# EAGLE design Lüftung_230217 (EAGLE 9.6.2)
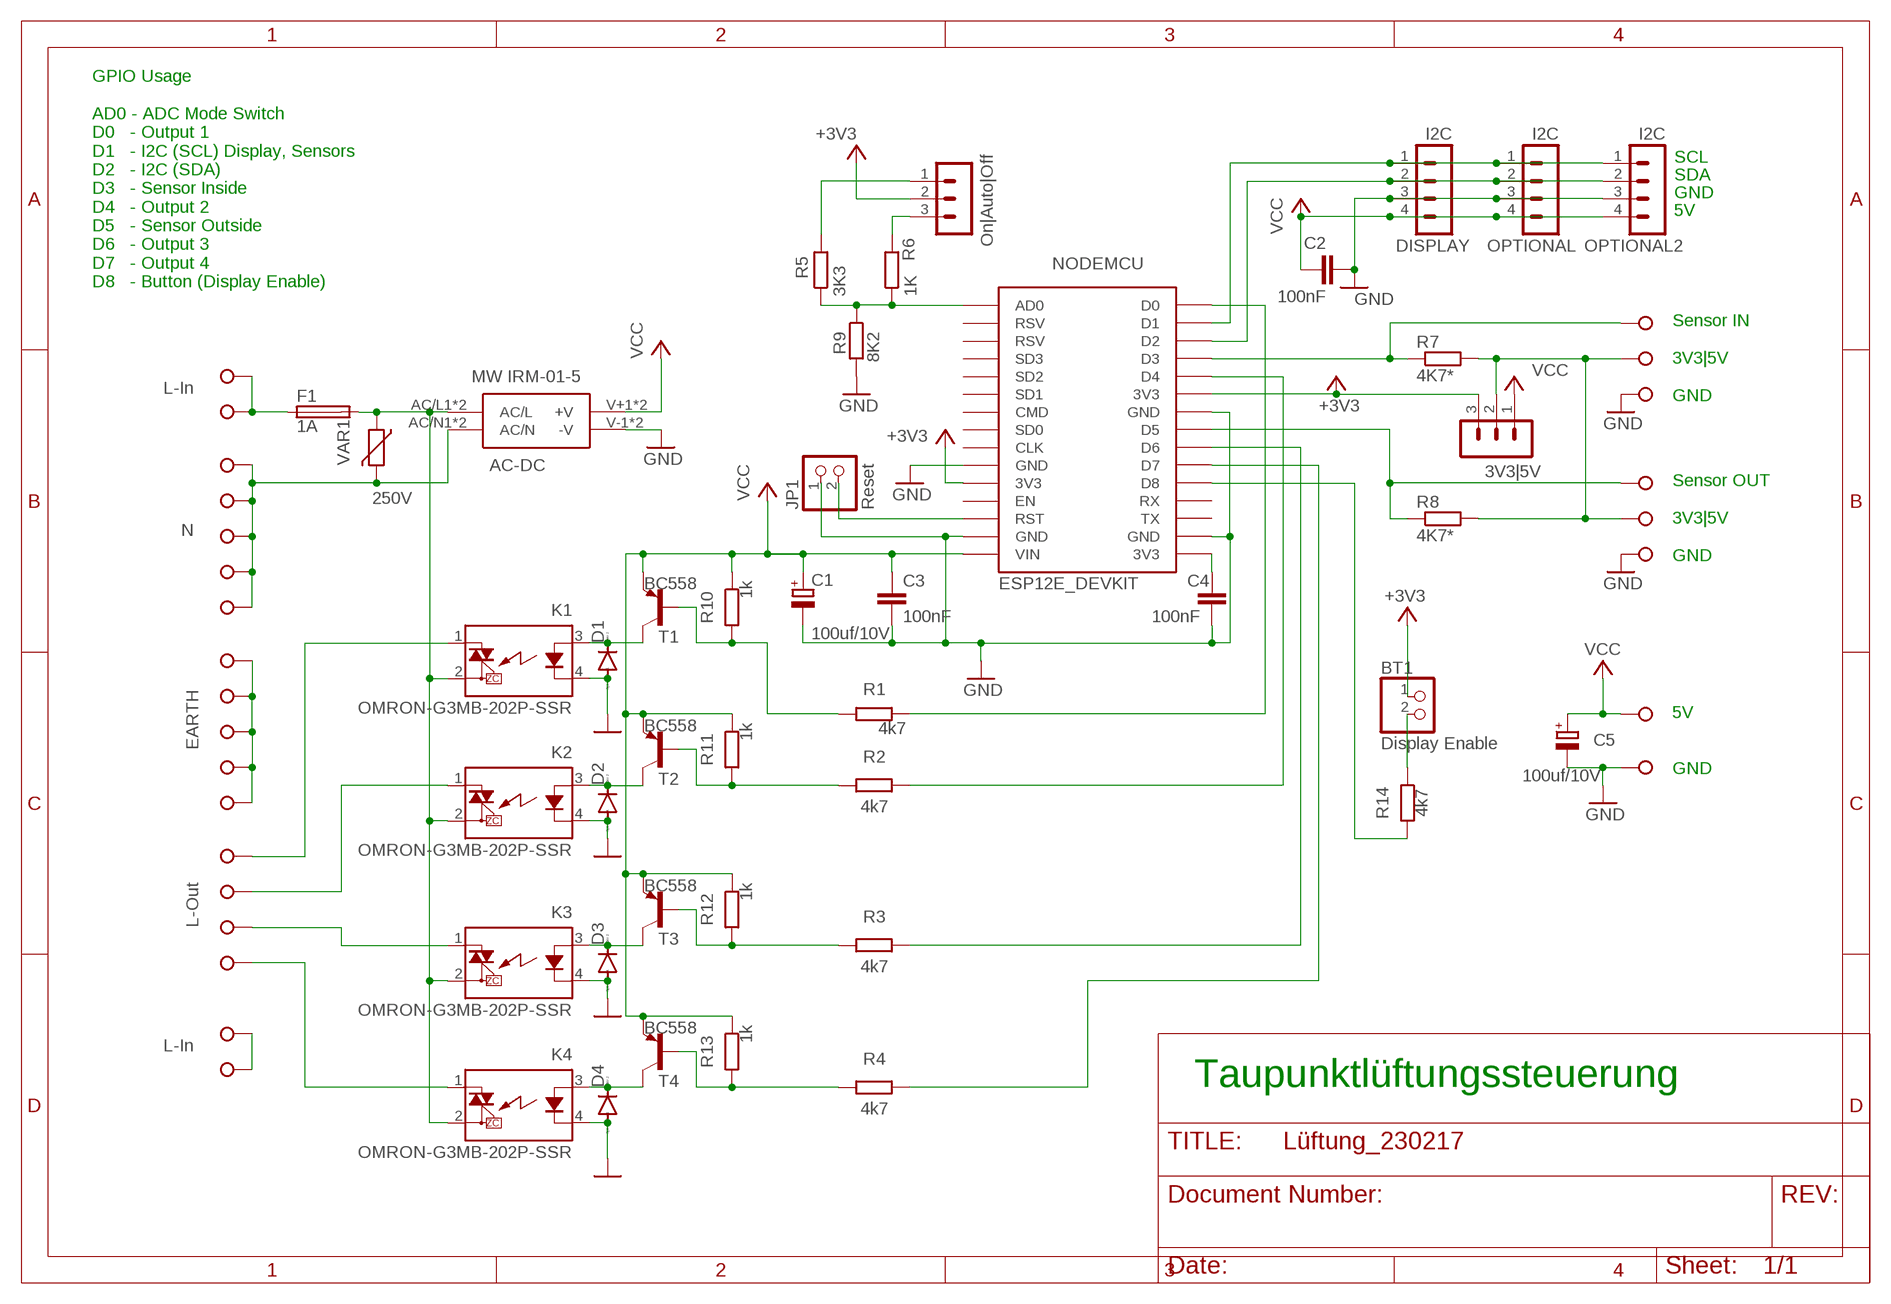
[diagram p0: schematic, sheet 1]

## Parts
5V|3V3  3V3|5V  LüFTUNG_230217_2_CON-LSTB_MA03-1  [LüFTUNG_230217_2_CON-LSTB_MA03-1]
AC-DC  MW IRM-01-5  LüFTUNG_230217_2_SAMACSYS_PARTS_IRM-01-5  [LüFTUNG_230217_2_SAMACSYS_PARTS_IRM015]
BT1  Display Enable  LüFTUNG_230217_2_PINHEAD_PINHD-1X2  [LüFTUNG_230217_2_PINHEAD_1X02]
C1  100uf/10V  LüFTUNG_230217_2_MY_RCL_CPOL-EUE2.5-7  [LüFTUNG_230217_2_MY_RCL_E2,5-7]
C2  100nF  LüFTUNG_230217_2_CAPACITOR-WIMA_C5/3.5  [LüFTUNG_230217_2_CAPACITOR-WIMA_C5B3.5]
C3  100nF  LüFTUNG_230217_2_CAPACITOR-WIMA_C5/3.5  [LüFTUNG_230217_2_CAPACITOR-WIMA_C5B3.5]
C4  100nF  LüFTUNG_230217_2_CAPACITOR-WIMA_C5/3.5  [LüFTUNG_230217_2_CAPACITOR-WIMA_C5B3.5]
C5  100uf/10V  LüFTUNG_230217_2_MY_RCL_CPOL-EUE2.5-7  [LüFTUNG_230217_2_MY_RCL_E2,5-7]
D1  LüFTUNG_230217_2_DIODE_1N4148  [LüFTUNG_230217_2_DIODE_D-5]
D2  LüFTUNG_230217_2_DIODE_1N4148DO35-7  [LüFTUNG_230217_2_DIODE_DO35-7]
D3  LüFTUNG_230217_2_DIODE_1N4148DO35-7  [LüFTUNG_230217_2_DIODE_DO35-7]
D4  LüFTUNG_230217_2_DIODE_1N4148DO35-7  [LüFTUNG_230217_2_DIODE_DO35-7]
DISPLAY  I2C  LüFTUNG_230217_2_CON-LSTB_MA04-1  [LüFTUNG_230217_2_CON-LSTB_MA04-1]
F1  1A  LüFTUNG_230217_2_MY_FUSE_FUSESH22,5  [LüFTUNG_230217_2_MY_FUSE_SH22,5]
JP1  Reset  LüFTUNG_230217_2_PINHEAD_PINHD-1X2  [LüFTUNG_230217_2_PINHEAD_1X02]
K1  OMRON-G3MB-202P-SSR  LüFTUNG_230217_2_OMRON-G3MB-202P-SSR_OMRON-G3MB-202P-SSR  [LüFTUNG_230217_2_OMRON-G3MB-202P-SSR_OMRON-G3MB-202P-SSR]
K2  OMRON-G3MB-202P-SSR  LüFTUNG_230217_2_OMRON-G3MB-202P-SSR_OMRON-G3MB-202P-SSR  [LüFTUNG_230217_2_OMRON-G3MB-202P-SSR_OMRON-G3MB-202P-SSR]
K3  OMRON-G3MB-202P-SSR  LüFTUNG_230217_2_OMRON-G3MB-202P-SSR_OMRON-G3MB-202P-SSR  [LüFTUNG_230217_2_OMRON-G3MB-202P-SSR_OMRON-G3MB-202P-SSR]
K4  OMRON-G3MB-202P-SSR  LüFTUNG_230217_2_OMRON-G3MB-202P-SSR_OMRON-G3MB-202P-SSR  [LüFTUNG_230217_2_OMRON-G3MB-202P-SSR_OMRON-G3MB-202P-SSR]
NODEMCU  ESP12E_DEVKIT  LüFTUNG_230217_2_ESP12E_DEVKIT_ESP12E_DEVKIT  [LüFTUNG_230217_2_ESP12E_DEVKIT_ESP12E_DEVKIT]
OPTIONAL  I2C  LüFTUNG_230217_2_CON-LSTB_MA04-1  [LüFTUNG_230217_2_CON-LSTB_MA04-1]
OPTIONAL2  I2C  LüFTUNG_230217_2_CON-LSTB_MA04-1  [LüFTUNG_230217_2_CON-LSTB_MA04-1]
R1  4k7  LüFTUNG_230217_2_MY_RCL_R-EU_0207/10  [LüFTUNG_230217_2_MY_RCL_0207/10]
R2  4k7  LüFTUNG_230217_2_MY_RCL_R-EU_0207/10  [LüFTUNG_230217_2_MY_RCL_0207/10]
R3  4k7  LüFTUNG_230217_2_MY_RCL_R-EU_0207/10  [LüFTUNG_230217_2_MY_RCL_0207/10]
R4  4k7  LüFTUNG_230217_2_MY_RCL_R-EU_0207/10  [LüFTUNG_230217_2_MY_RCL_0207/10]
R5  3K3  LüFTUNG_230217_2_MY_RCL_R-EU_0204/2V  [LüFTUNG_230217_2_MY_RCL_0204V]
R6  1K  LüFTUNG_230217_2_MY_RCL_R-EU_0204/2V  [LüFTUNG_230217_2_MY_RCL_0204V]
R7  4K7*  LüFTUNG_230217_2_MY_RCL_R-EU_0207/10  [LüFTUNG_230217_2_MY_RCL_0207/10]
R8  4K7*  LüFTUNG_230217_2_MY_RCL_R-EU_0207/10  [LüFTUNG_230217_2_MY_RCL_0207/10]
R9  8K2  LüFTUNG_230217_2_MY_RCL_R-EU_0204/2V  [LüFTUNG_230217_2_MY_RCL_0204V]
R10  1k  LüFTUNG_230217_2_MY_RCL_R-EU_0207/10  [LüFTUNG_230217_2_MY_RCL_0207/10]
R11  1k  LüFTUNG_230217_2_MY_RCL_R-EU_0207/10  [LüFTUNG_230217_2_MY_RCL_0207/10]
R12  1k  LüFTUNG_230217_2_MY_RCL_R-EU_0207/10  [LüFTUNG_230217_2_MY_RCL_0207/10]
R13  1k  LüFTUNG_230217_2_MY_RCL_R-EU_0207/10  [LüFTUNG_230217_2_MY_RCL_0207/10]
R14  4k7  LüFTUNG_230217_2_MY_RCL_R-EU_0207/10  [LüFTUNG_230217_2_MY_RCL_0207/10]
SWITCH  On|Auto|Off  LüFTUNG_230217_2_CON-LSTB_MA03-1  [LüFTUNG_230217_2_CON-LSTB_MA03-1]
T1  BC558  LüFTUNG_230217_2_TRANSISTOR-NEU-TO92_-PNP-TO92  [LüFTUNG_230217_2_TRANSISTOR-NEU-TO92_TO92]
T2  BC558  LüFTUNG_230217_2_TRANSISTOR-NEU-TO92_-PNP-TO92  [LüFTUNG_230217_2_TRANSISTOR-NEU-TO92_TO92]
T3  BC558  LüFTUNG_230217_2_TRANSISTOR-NEU-TO92_-PNP-TO92  [LüFTUNG_230217_2_TRANSISTOR-NEU-TO92_TO92]
T4  BC558  LüFTUNG_230217_2_TRANSISTOR-NEU-TO92_-PNP-TO92  [LüFTUNG_230217_2_TRANSISTOR-NEU-TO92_TO92]
VAR1  250V  LüFTUNG_230217_2_MY_VARISTOR_VARISTOR-5  [LüFTUNG_230217_2_MY_VARISTOR_R-5]
X1  L-In  CON-WAGO-508_W236-1  [CON-WAGO-508_W236-1]
X2  L-In  CON-WAGO-508_W236-1CON-WAGO-508_W236-NOCAP  [CON-WAGO-508_W236-NOCAP]
X3  N  CON-WAGO-508_W236-1  [CON-WAGO-508_W236-1]
X4  N  CON-WAGO-508_W236-1CON-WAGO-508_W236-NOCAP  [CON-WAGO-508_W236-NOCAP]
X5  N  CON-WAGO-508_W236-1CON-WAGO-508_W236-NOCAP  [CON-WAGO-508_W236-NOCAP]
X6  N  CON-WAGO-508_W236-1CON-WAGO-508_W236-NOCAP  [CON-WAGO-508_W236-NOCAP]
X7  N  CON-WAGO-508_W236-1CON-WAGO-508_W236-NOCAP  [CON-WAGO-508_W236-NOCAP]
X8  EARTH  CON-WAGO-508_W236-1  [CON-WAGO-508_W236-1]
X9  EARTH  CON-WAGO-508_W236-1CON-WAGO-508_W236-NOCAP  [CON-WAGO-508_W236-NOCAP]
X10  EARTH  CON-WAGO-508_W236-1CON-WAGO-508_W236-NOCAP  [CON-WAGO-508_W236-NOCAP]
X11  EARTH  CON-WAGO-508_W236-1CON-WAGO-508_W236-NOCAP  [CON-WAGO-508_W236-NOCAP]
X12  EARTH  CON-WAGO-508_W236-1CON-WAGO-508_W236-NOCAP  [CON-WAGO-508_W236-NOCAP]
X13  L-Out  CON-WAGO-508_W236-1  [CON-WAGO-508_W236-1]
X14  L-Out  CON-WAGO-508_W236-1CON-WAGO-508_W236-NOCAP  [CON-WAGO-508_W236-NOCAP]
X15  L-Out  CON-WAGO-508_W236-1CON-WAGO-508_W236-NOCAP  [CON-WAGO-508_W236-NOCAP]
X16  L-Out  CON-WAGO-508_W236-1CON-WAGO-508_W236-NOCAP  [CON-WAGO-508_W236-NOCAP]
X17  L-In  CON-WAGO-508_W236-1CON-WAGO-508_W236-NOCAP  [CON-WAGO-508_W236-NOCAP]
X18  L-In  CON-WAGO-508_W236-1  [CON-WAGO-508_W236-1]
X19  Sensor-In  CON-WAGO-508_W236-1CON-WAGO-508_W236-NOCAP  [CON-WAGO-508_W236-NOCAP]
X20  3V3  CON-WAGO-508_W236-1CON-WAGO-508_W236-NOCAP  [CON-WAGO-508_W236-NOCAP]
X21  GND  CON-WAGO-508_W236-1  [CON-WAGO-508_W236-1]
X22  Sensor-Out  CON-WAGO-508_W236-1CON-WAGO-508_W236-NOCAP  [CON-WAGO-508_W236-NOCAP]
X23  3V3  CON-WAGO-508_W236-1CON-WAGO-508_W236-NOCAP  [CON-WAGO-508_W236-NOCAP]
X24  GND  CON-WAGO-508_W236-1  [CON-WAGO-508_W236-1]
X25  GND  CON-WAGO-508_W236-1CON-WAGO-508_W236-NOCAP  [CON-WAGO-508_W236-NOCAP]
X26  VCC  CON-WAGO-508_W236-1  [CON-WAGO-508_W236-1]

## Nets
230V-SWITCH [230V]: X17.1(KL1) X17.2(KL1) X18.1(KL1) X18.2(KL1)
+3V3: 5V|3V3.3 BT1.1 NODEMCU.3V3@0(3V3) NODEMCU.3V3@1(3V3) SWITCH.2
EARTH: X8.1(KL1) X8.2(KL1) X9.1(KL1) X9.2(KL1) X10.1(KL1) X10.2(KL1) X11.1(KL1) X11.2(KL1) X12.1(KL1) X12.2(KL1)
GND: AC-DC.V-1(-V) AC-DC.V-2(-V) C1.- C2.2 C3.2 C4.2 C5.- D1.A D2.A D3.A D4.A DISPLAY.3 JP1.1 K1.4(K) K2.4(K) K3.4(K) K4.4(K) NODEMCU.GND@0(GND) NODEMCU.GND@1(GND) NODEMCU.GND@2(GND) NODEMCU.GND@3(GND) OPTIONAL2.3 OPTIONAL.3 R9.2 X21.1(KL1) X21.2(KL1) X24.1(KL1) X24.2(KL1) X25.1(KL1) X25.2(KL1) ; supply symbol labelled SUPPLY1_GND
L [230V]: F1.1 X1.1(KL1) X1.2(KL1) X2.1(KL1) X2.2(KL1)
L2 [230V]: K2.1(DS1) X14.1(KL1) X14.2(KL1)
L3 [230V]: K3.1(DS1) X15.1(KL1) X15.2(KL1)
L4 [230V]: K4.1(DS1) X16.1(KL1) X16.2(KL1)
L-OUT [230V]: K1.1(DS1) X13.1(KL1) X13.2(KL1)
LF [230V]: AC-DC.AC/L1(AC/L) AC-DC.AC/L2(AC/L) F1.2 K1.2(DS2) K2.2(DS2) K3.2(DS2) K4.2(DS2) VAR1.1
N [230V]: AC-DC.AC/N1(AC/N) AC-DC.AC/N2(AC/N) VAR1.2 X3.1(KL1) X3.2(KL1) X4.1(KL1) X4.2(KL1) X5.1(KL1) X5.2(KL1) X6.1(KL1) X6.2(KL1) X7.1(KL1) X7.2(KL1)
N$1: DISPLAY.1 NODEMCU.D1 OPTIONAL2.1 OPTIONAL.1
N$2: R1.2 R10.2 T1.2(B)
N$3: NODEMCU.D5 R8.1 X22.1(KL1) X22.2(KL1)
N$4: D1.C K1.3(A) T1.3(C)
N$5: NODEMCU.D0 R1.1
N$6: 5V|3V3.2 R7.2 R8.2 X20.1(KL1) X20.2(KL1) X23.1(KL1) X23.2(KL1)
N$7: D4.C K4.3(A) T4.3(C)
N$8: D3.C K3.3(A) T3.3(C)
N$9: R6.2 SWITCH.3
N$10: D2.C K2.3(A) T2.3(C)
N$11: NODEMCU.D4 R2.1
N$12: NODEMCU.D6 R3.1
N$13: NODEMCU.D7 R4.1
N$14: DISPLAY.2 NODEMCU.D2 OPTIONAL2.2 OPTIONAL.2
N$15: NODEMCU.AD0 R5.1 R6.1 R9.1
N$16: R5.2 SWITCH.1
N$17: C4.1 NODEMCU.3V3@2(3V3)
N$18: R2.2 R11.2 T2.2(B)
N$19: R3.2 R12.2 T3.2(B)
N$20: R4.2 R13.2 T4.2(B)
N$21: BT1.2 R14.1
N$22: NODEMCU.D8 R14.2
RST: JP1.2 NODEMCU.RST
SENS_IN: NODEMCU.D3 R7.1 X19.1(KL1) X19.2(KL1)
VCC: 5V|3V3.1 AC-DC.V+1(+V) AC-DC.V+2(+V) C1.+ C2.1 C3.1 C5.+ DISPLAY.4 NODEMCU.VIN OPTIONAL2.4 OPTIONAL.4 R10.1 R11.1 R12.1 R13.1 T1.1(E) T2.1(E) T3.1(E) T4.1(E) X26.1(KL1) X26.2(KL1)
Unconnected: NODEMCU.CLK NODEMCU.CMD NODEMCU.EN NODEMCU.RSV@0(RSV) NODEMCU.RSV@1(RSV) NODEMCU.RX NODEMCU.SD0 NODEMCU.SD1 NODEMCU.SD2 NODEMCU.SD3 NODEMCU.TX

## Notes on the sheet
- SCL
- SDA
- GND
- 5V
- GPIO Usage
  
  AD0 - ADC Mode Switch
  D0   - Output 1
  D1   - I2C (SCL) Display, Sensors
  D2   - I2C (SDA)
  D3   - Sensor Inside
  D4   - Output 2
  D5   - Sensor Outside
  D6   - Output 3
  D7   - Output 4
  D8   - Button (Display Enable)
- Sensor IN
  
  3V3|5V
  
  GND
- Sensor OUT
  
  3V3|5V
  
  GND
- 5V
  
  
  GND
- Taupunktlüftungssteuerung

## Library data of the parts
5V|3V3 SWITCH = Lüftung_230217_2:LüFTUNG_230217_2_CON-LSTB_MA03-1: PIN HEADER; OC_FARNELL: unknown; OC_NEWARK: unknown
AC-DC = Lüftung_230217_2:LüFTUNG_230217_2_SAMACSYS_PARTS_IRM-01-5: Power Supply Encapsulated PCB 5V 1W Source: Datasheet <https://www.meanwell.com/Upload/PDF/IRM-01/IRM-01-SPEC.PDF>; DESCRIPTION: Power Supply Encapsulated PCB 5V 1W; HEIGHT: 15mm; MANUFACTURER_NAME: Mean Well; MANUFACTURER_PART_NUMBER: IRM-01-5; MOUSER_PART_NUMBER: 709-IRM01-5; MOUSER_PRICE-STOCK: https://www.mouser.co.uk/ProductDetail/MEAN-WELL/IRM-01-5?qs=C9r8PV%2F%252BoWMaYlcx2eavRQ%3D%3D
BT1 JP1 = Lüftung_230217_2:LüFTUNG_230217_2_PINHEAD_PINHD-1X2: PIN HEADER
C1 C5 = Lüftung_230217_2:LüFTUNG_230217_2_MY_RCL_CPOL-EU: POLARIZED CAPACITOR, European symbol; SPICEPREFIX: C
C2-C4 = Lüftung_230217_2:LüFTUNG_230217_2_CAPACITOR-WIMA_C: CAPACITOR naming: grid - package width
D1-D4 = Lüftung_230217_2:LüFTUNG_230217_2_DIODE_1N4148: DIODE high speed (Philips)
DISPLAY OPTIONAL OPTIONAL2 = Lüftung_230217_2:LüFTUNG_230217_2_CON-LSTB_MA04-1: PIN HEADER; OC_FARNELL: unknown; OC_NEWARK: unknown
F1 = Lüftung_230217_2:LüFTUNG_230217_2_MY_FUSE_FUSE: Fuse; OC_FARNELL: unknown; OC_NEWARK: unknown
K1-K4 = Lüftung_230217_2:LüFTUNG_230217_2_OMRON-G3MB-202P-SSR_OMRON-G3MB-202P-SSR: IT(rms) 8A, Zero Cross type SIP 4pin Triac output SSR Source: http://sharp-world.com/products/device/lineup/data/pdf/datasheet/s102s02_e.pdf
NODEMCU = Lüftung_230217_2:LüFTUNG_230217_2_ESP12E_DEVKIT_ESP12E_DEVKIT: ESP12E DEVKIT BOARD
R1-R14 = Lüftung_230217_2:LüFTUNG_230217_2_MY_RCL_R-EU_: RESISTOR, European symbol; SPICEPREFIX: R
T1-T4 = Lüftung_230217_2:LüFTUNG_230217_2_TRANSISTOR-NEU-TO92_*-PNP-: PNP Transistror
VAR1 = Lüftung_230217_2:LüFTUNG_230217_2_MY_VARISTOR_VARISTOR: VARISTOR
X1 X3 X8 X13 X18 X21 X24 X26 = Lüftung_230217_2:CON-WAGO-508_W236-1: WAGO SREW CLAMP; OC_FARNELL: unknown; OC_NEWARK: unknown
X2 X4-X7 X9-X12 X14-X17 X19 X20 X22 X23 X25 = Lüftung_230217_2:CON-WAGO-508_W236-1: WAGO SREW CLAMP

## Net classes
0 default: width 0.305 mm
1 230V: width 1.016 mm, clearance 1.5 mm

## Board
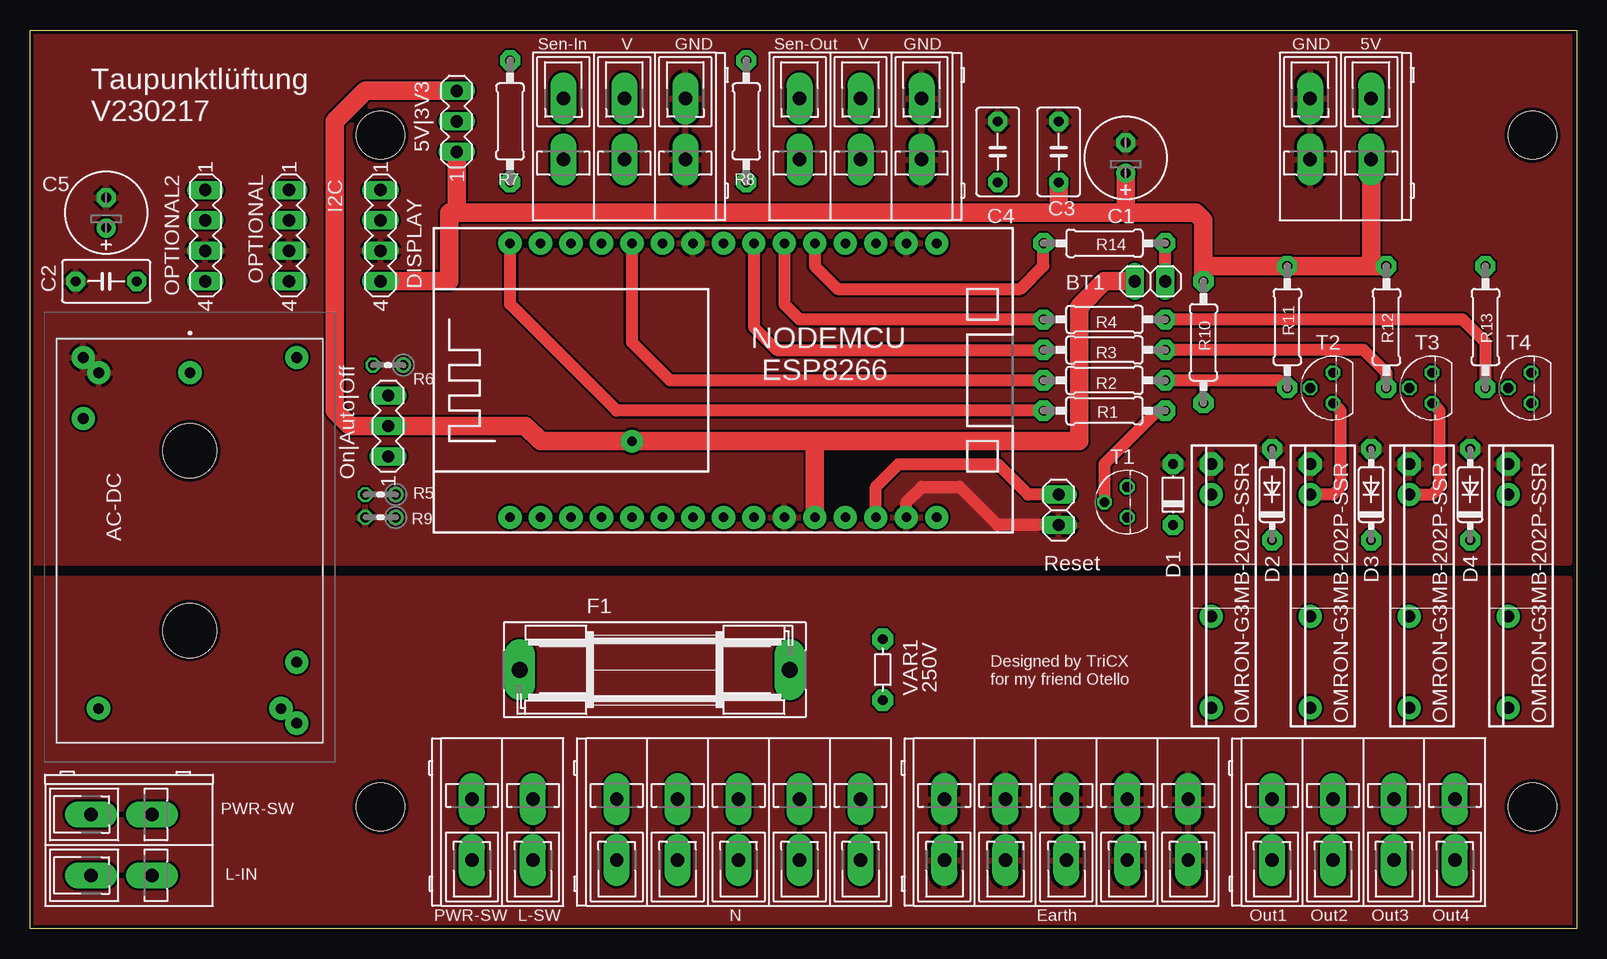
[diagram p1: board, top side]
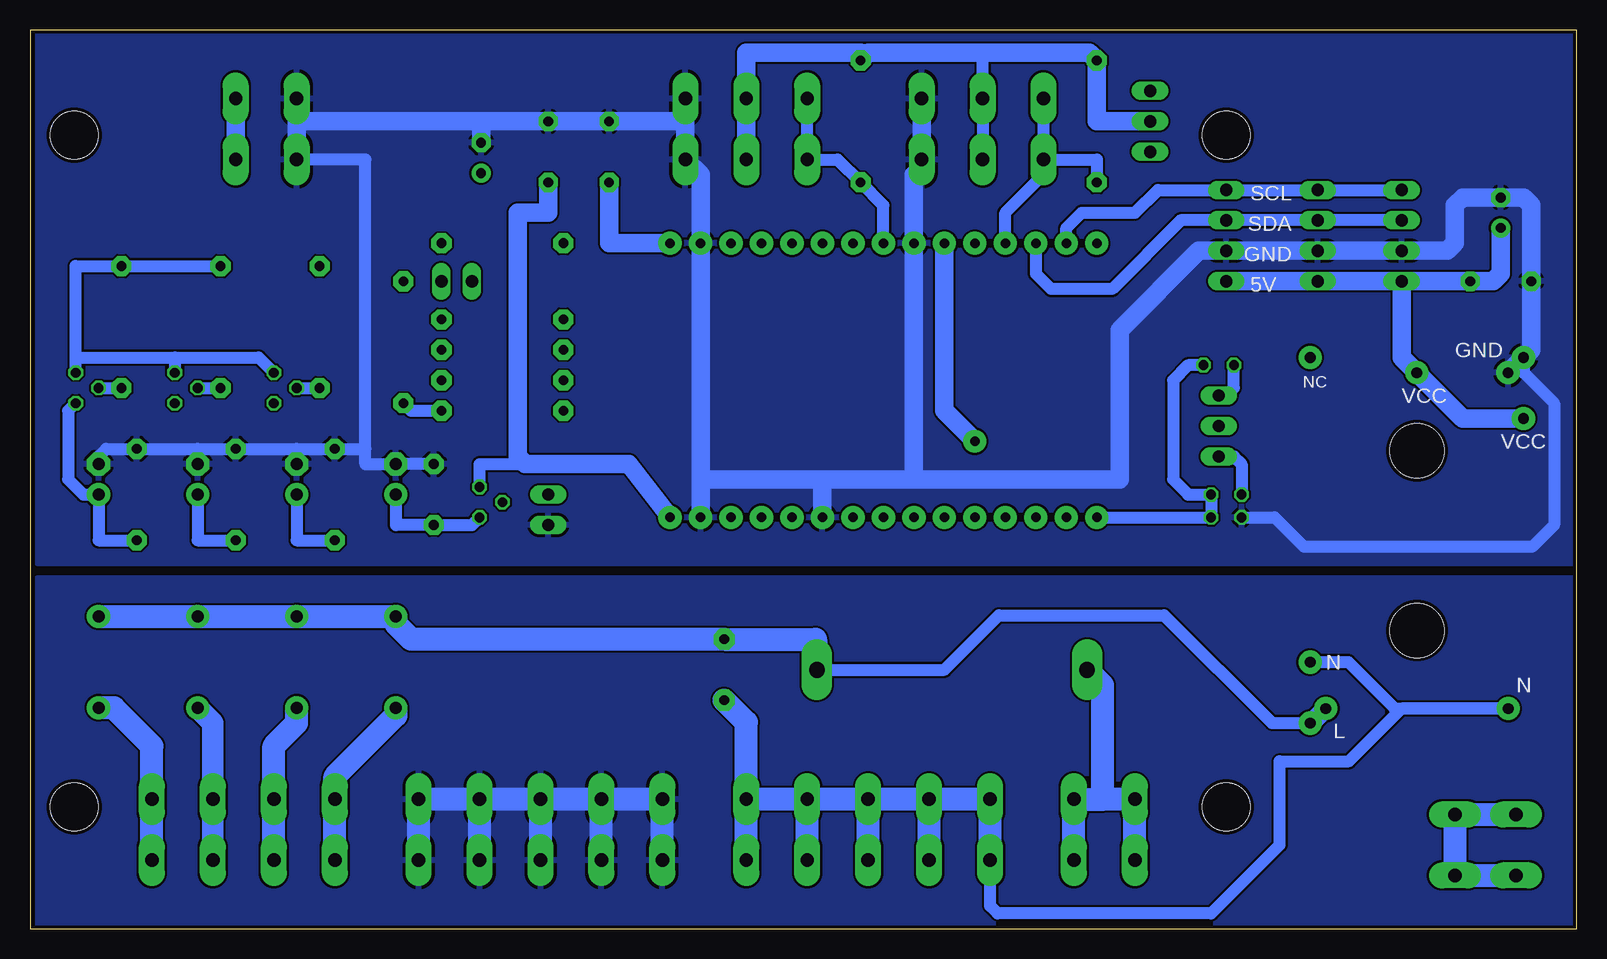
[diagram p2: board, bottom side, seen from below]

Size 128.91 x 74.93 mm. Coordinates in mm from the lower left corner, seen from the top.
Outline: 0,0 0,74.93 128.91,74.93 128.91,0 0,0
Copper layers (1*16): Top 0.035mm / dielectric 1.5mm / Bottom 0.035mm
Design rules "aisler_2_layer_simple": minimum track width 0.2mm, minimum drill 0.45mm, track to track 0.175mm, track to pad 0.175mm, pad to pad 0.175mm, via to via 0.175mm, smd to smd 0.175mm, copper to edge 0.3mm, drill to drill 0.25mm, minimum pad ring 0.2mm, minimum via ring 0.2mm, stop-mask expansion 0mil, vias tented up to drill 0mil, thermal gap 10mil
Holes 4 mm at 29.21,66.16 29.21,10.16 125.21,10.16 125.21,66.16

### Footprints (pad centres in the part's own frame; a part is rotated, then mirrored left to right if it is on the bottom)
LüFTUNG_230217_2_CON-LSTB_MA03-1 = drill 1.016 long: 1 -2.54,0; 2 0,0; 3 2.54,0
LüFTUNG_230217_2_SAMACSYS_PARTS_IRM015 = drill 0.9 pad 1.93: AC/L1 28,7.58; AC/L2 29.21,8.89; AC/N1 28,-7.62; AC/N2 24.13,8.89; NC -1.27,8.89; V+1 0,0; V+2 3.81,-8.89; V-1 0,-7.6; V-2 -1.27,-8.89 | hole 4.5: 6.5,-0.02; 21.5,-0.02
LüFTUNG_230217_2_PINHEAD_1X02 = drill 1.016 long: 1 -1.27,0; 2 1.27,0
LüFTUNG_230217_2_MY_RCL_E2,5-7 = drill 0.813 pad 1.6: + -1.27,0 | drill 0.813 pad 1.6 octagon: - 1.27,0
LüFTUNG_230217_2_CAPACITOR-WIMA_C5B3.5 = drill 0.813 pad 1.6 octagon: 1 -2.54,0; 2 2.54,0
LüFTUNG_230217_2_DIODE_D-5 = drill 0.813 pad 1.676 octagon: A 2.54,0; C -2.54,0
LüFTUNG_230217_2_DIODE_DO35-7 = drill 0.813 pad 1.676 octagon: A 3.81,0; C -3.81,0
LüFTUNG_230217_2_CON-LSTB_MA04-1 = drill 1.016 long: 1 -3.81,0; 2 -1.27,0; 3 1.27,0; 4 3.81,0
LüFTUNG_230217_2_MY_FUSE_SH22,5 = drill 1.321 pad 2.54 long: 1 -11.252,0; 2 11.252,0
LüFTUNG_230217_2_OMRON-G3MB-202P-SSR_OMRON-G3MB-202P-SSR = drill 1 pad 1.93: 1 -10.16,0; 2 -2.54,0; 3 7.62,0 | drill 1 pad 1.93 octagon: 4 10.16,0
LüFTUNG_230217_2_ESP12E_DEVKIT_ESP12E_DEVKIT = drill 0.8 pad 1.93: 3V3@0 -11.43,-7.62; 3V3@1 11.43,5.08; 3V3@2 11.43,-17.78; AD0 -11.43,17.78; CLK -11.43,-2.54; CMD -11.43,2.54; D0 11.43,17.78; D1 11.43,15.24; D2 11.43,12.7; D3 11.43,10.16; D4 11.43,7.62; D5 11.43,0; D6 11.43,-2.54; D7 11.43,-5.08; D8 11.43,-7.62; EN -11.43,-10.16; GND@0 -11.43,-5.08; GND@1 -11.43,-15.24; GND@2 11.43,2.54; GND@3 11.43,-15.24; RST -11.43,-12.7; RSV@0 -11.43,15.24; RSV@1 -11.43,12.7; RX 11.43,-10.16; SD0 -11.43,0; SD1 -11.43,5.08; SD2 -11.43,7.62; SD3 -11.43,10.16; TX 11.43,-12.7; VIN -11.43,-17.78
LüFTUNG_230217_2_MY_RCL_0207/10 = drill 0.813 pad 1.676 octagon: 1 -5.08,0; 2 5.08,0
LüFTUNG_230217_2_MY_RCL_0204V = drill 0.813 octagon: 1 -1.27,0; 2 1.27,0
LüFTUNG_230217_2_TRANSISTOR-NEU-TO92_TO92 = drill 0.813 octagon: 1 1.27,0; 2 0,1.905; 3 -1.27,0
LüFTUNG_230217_2_MY_VARISTOR_R-5 = drill 0.813 pad 1.778 octagon: 1 -2.54,0; 2 2.54,0
CON-WAGO-508_W236-1 = drill 1.118 pad 2.184 long: 1 0,-2.54; 2 0,2.54
CON-WAGO-508_W236-NOCAP = drill 1.118 pad 2.184 long: 1 0,-2.54; 2 0,2.54

### Placement (x,y rotation side)
5V|3V3  35.56,67.31 90 top
AC-DC  13.34,46.36 270 top
BT1  93.34,53.97 0 top
C1  91.31,64.26 90 top
C2  6.35,53.97 180 top
C3  85.72,64.77 90 top
C4  80.65,64.77 90 top
C5  6.35,59.69 90 top
D1  95.25,36.2 90 top
D2  103.5,36.2 90 top
D3  111.76,36.2 90 top
D4  120.02,36.2 90 top
DISPLAY  29.21,57.78 270 top
F1  52.07,21.59 0 top
JP1  85.72,34.92 90 top
K1  98.43,28.57 90 top
K2  106.68,28.57 90 top
K3  114.94,28.57 90 top
K4  123.19,28.57 90 top
NODEMCU  57.78,45.72 90 top
OPTIONAL  21.59,57.78 270 top
OPTIONAL2  14.61,57.78 270 top
R1  89.53,43.18 0 top
R2  89.53,45.72 0 top
R3  89.53,48.26 0 top
R4  89.53,50.8 0 top
R5  29.21,36.2 180 top
R6  29.85,46.99 180 top
R7  40.01,67.31 90 top
R8  59.69,67.31 90 top
R9  29.21,34.29 180 top
R10  97.79,48.89 270 top
R11  104.78,50.17 270 top
R12  113.03,50.17 270 top
R13  121.28,50.17 270 top
R14  89.53,57.15 180 top
SWITCH  29.85,41.91 90 top
T1  91.44,35.56 90 top
T2  108.59,45.08 90 top
T3  116.84,45.08 90 top
T4  125.09,45.08 90 top
VAR1  71.06,21.59 270 top
X1  36.83,8.26 0 top
X2  41.91,8.26 0 top
X3  48.89,8.26 0 top
X4  53.98,8.26 0 top
X5  59.05,8.26 0 top
X6  64.13,8.26 0 top
X7  69.22,8.26 0 top
X8  76.2,8.26 0 top
X9  81.28,8.26 0 top
X10  86.36,8.26 0 top
X11  91.44,8.26 0 top
X12  96.52,8.26 0 top
X13  103.5,8.26 0 top
X14  108.59,8.26 0 top
X15  113.66,8.26 0 top
X16  118.75,8.26 0 top
X17  7.62,4.45 270 top
X18  7.62,9.53 270 top
X19  44.45,66.67 180 top
X20  49.53,66.67 180 top
X21  54.61,66.67 180 top
X22  64.13,66.67 180 top
X23  69.22,66.67 180 top
X24  74.3,66.67 180 top
X25  106.68,66.67 180 top
X26  111.76,66.67 180 top

### Tracks (layer width: path | path; a pad name or v marks a point on that pad's centre or on a via)
230V-SWITCH
  Bottom 1.905: X17.1 X17.2 X18.2 X18.1
+3V3  (via drill 0.8 pad 1.91)
  Top 1.524: 65.41,40.64 v50.16,40.64 42.55,40.64 41.27,41.91 SWITCH.2 26.67,41.91 25.4,43.18 25.4,67.31 27.94,69.85 5V|3V3.3 | NODEMCU.3V3@0 65.41,40.64 | 65.41,40.64 87.43,40.64 87.43,51.87 89.53,53.97 BT1.1
  Bottom 1.524: NODEMCU.3V3@1 52.7,43.18 v50.16,40.64
EARTH
  Bottom 1.905: X12.1 X12.2 X11.2 | X11.1 X11.2 | X10.1 X10.2 | X9.1 X9.2 | X8.1 X8.2 X9.2 | X9.2 X10.2 | X10.2 X11.2
  pour Top: -0.63,29.21 128.27,29.21 128.27,0 -0.63,0
  pour Bottom: -0.63,29.21 128.27,29.21 128.27,0 -0.63,0
GND
  Top 1.016: NODEMCU.GND@1 73.03,35.56 74.3,36.83 77.47,36.83 80.65,33.66 JP1.1
  Bottom 1.016: 106.68,40 K2.4 | 106.68,40 D2.A 100.97,40 | 114.94,40 D3.A 106.68,40 | 114.94,40 K3.4 | K4.4 123.19,39.37 122.56,40 D4.A 114.94,40 | 100.97,40 100.97,38.73 K1.4 D1.A | AC-DC.V-2 4.45,46.36 1.91,43.81 1.91,33.66 3.73,31.83 22.72,31.83 25.18,34.29 R9.2 | X25.2 100.97,64.14 100.97,40
  Bottom 1.524: 55.25,37.47 NODEMCU.GND@2 55.25,62.86 54.61,63.5 X21.2 X21.1 | 62.87,37.47 55.25,37.47 | NODEMCU.GND@1 73.03,37.47 | 73.03,37.47 NODEMCU.GND@3 73.03,62.86 X24.2 74.3,67.31 | NODEMCU.GND@0 62.87,37.47 | 62.87,37.47 73.03,37.47 | 55.25,37.47 38.1,37.47 38.1,49.91 31.5,56.52 DISPLAY.3 OPTIONAL.3 OPTIONAL2.3 10.8,56.52 10.16,57.15 10.16,60.33 9.53,60.96 C5.- 4.45,60.96 3.81,60.33 C2.2 3.81,48.26 AC-DC.V-2 4.46,47.62 AC-DC.V-1 | 91.44,67.31 106.68,67.31 X25.1 X25.2 | 91.44,67.31 C3.2 C4.2 74.3,67.31 | C1.- 91.31,67.18 91.44,67.31 | 74.3,67.31 X24.1
  pour Bottom: -0.63,30.48 -0.63,74.93 128.27,74.93 128.27,30.48
  pour Top: -0.63,30.48 -0.63,74.93 128.27,74.93 128.27,30.48
L
  Bottom 1.905: 39.37,10.79 X1.2 X1.1 | F1.1 39.55,20.32 39.55,10.97 39.37,10.79 | 39.37,10.79 X2.2 X2.1
L2
  Bottom 1.905: X14.1 X14.2 108.59,15.24 106.68,17.14 K2.1
L3
  Bottom 1.778: X15.1 X15.2 113.66,17.14 K3.1
L4
  Bottom 1.905: X16.1 X16.2 118.75,15.24 121.92,18.41 K4.1
L-OUT
  Bottom 1.905: X13.1 X13.2 103.5,12.7 98.43,17.78 K1.1
LF
  Bottom 1.016: F1.2 52.7,21.59 48.16,26.14 34.39,26.14 25.4,17.14 AC-DC.AC/L2
  Bottom 1.524: AC-DC.AC/L1 22.12,17.14 AC-DC.AC/L2
  Bottom 1.905: F1.2 63.44,21.7 63.44,24.13 VAR1.1 97.16,24.13 98.43,25.4 K1.2 K2.2 K3.2 K4.2
N
  Bottom 1.016: AC-DC.AC/N2 19.05,22.23 15.18,18.36 AC-DC.AC/N1 14.61,18.36 18.99,13.97 24.77,13.97 24.77,6.99 30.48,1.27 48.26,1.27 48.89,1.9 X3.1
  Bottom 1.905: X4.2 X3.2 X3.1 | X4.2 X5.2 | X5.2 X6.2 | X6.2 X7.2 | X4.1 X4.2 | X5.1 X5.2 | X6.1 X6.2 | X7.1 X7.2 | X7.2 69.22,17.21 VAR1.2
N$1
  Bottom 1.016: NODEMCU.D1 42.55,58.42 41.27,59.69 36.83,59.69 34.92,61.59 DISPLAY.1 OPTIONAL.1 OPTIONAL2.1
N$2
  Top 1.016: R1.2 93.98,43.18 89.53,38.73 T1.2
  Bottom 1.016: R10.2 97.16,43.18 R1.2
N$3
  Bottom 1.016: X22.1 X22.2 61.59,64.14 R8.1 57.78,60.33 NODEMCU.D5
N$4
  Bottom 1.016: K1.3 98.43,33.66 D1.C 92.08,33.66 T1.3
N$5
  Top 1.016: R1.1 48.89,43.18 40.01,52.07 NODEMCU.D0
N$6
  Bottom 1.016: X20.2 X20.1 49.53,73.03
  Bottom 1.524: X23.2 X23.1 69.22,73.03 59.69,73.03 R8.2 59.05,73.03 49.53,73.03 40.64,73.03 R7.2 40.01,67.31 5V|3V3.2
N$7
  Bottom 1.016: D4.C 123.19,32.39 K4.3 124.46,36.2 125.73,37.47 125.73,43.18 T4.3
N$8
  Top 1.016: K3.3 116.84,36.2 117.47,36.83 117.47,43.18 T3.3
  Bottom 1.016: K3.3 114.94,32.39 D3.C
N$9
  Bottom 1.016: SWITCH.3 29.21,44.45 28.57,45.08 R6.2
N$10
  Top 1.016: K2.3 108.59,36.2 109.22,36.83 109.22,43.18 T2.3
  Bottom 1.016: K2.3 106.68,32.39 D2.C
N$11
  Top 1.016: R2.1 53.34,45.72 50.16,48.89 NODEMCU.D4
N$12
  Top 1.016: NODEMCU.D6 60.33,50.17 62.23,48.26 R3.1
N$13
  Top 1.016: NODEMCU.D7 62.87,52.07 64.13,50.8 R4.1
N$14
  Bottom 1.016: NODEMCU.D2 45.09,54.61 43.81,53.34 38.73,53.34 33.02,59.06 DISPLAY.2 OPTIONAL.2 OPTIONAL2.2
N$15
  Bottom 1.016: NODEMCU.AD0 R9.1 R5.1 32.38,36.2 33.66,37.47 33.66,45.72 32.38,46.99 R6.1
N$16
  Bottom 1.016: SWITCH.1 28.57,39.37 27.94,38.73 R5.2
N$17
  Bottom 1.524: NODEMCU.3V3@2 80.65,57.15 C4.1
N$18
  Top 1.016: R2.2 104.14,45.72 R11.2
  Bottom 1.016: T2.2 R11.2
N$19
  Top 1.016: R3.2 111.12,48.26 113.03,46.36 R12.2
  Bottom 1.016: T3.2 R12.2
N$20
  Top 1.016: R4.2 119.38,50.8 121.28,48.89 R13.2
  Bottom 1.016: T4.2 R13.2
N$21
  Top 1.016: BT1.2 R14.1
N$22
  Top 1.016: NODEMCU.D8 65.41,55.25 67.31,53.34 82.55,53.34 84.45,55.25 R14.2
RST
  Top 1.016: NODEMCU.RST 70.48,36.83 72.39,38.73 80.65,38.73 83.19,36.2 JP1.2
SENS_IN
  Bottom 1.016: X19.1 X19.2 | NODEMCU.D3 47.62,59.69 44.45,62.86 X19.2 | X19.2 40.01,64.14 R7.1
VCC
  Top 1.524: DISPLAY.4 34.93,53.97 34.93,59.69 34.92,59.69 35.56,59.69 | R12.1 111.76,55.25 | 111.76,55.25 R11.1 97.79,55.25 | C3.1 85.72,59.69 | 91.31,59.69 97.16,59.69 97.79,59.06 97.79,55.25 | 91.31,59.69 85.72,59.69 | C1.+ 91.31,59.69 | 97.79,55.25 R10.1 | X26.2 111.76,55.25 | 5V|3V3.1 35.56,59.69 | 35.56,59.69 85.72,59.69
  Bottom 1.016: 116.84,47.62 109.85,47.62 T2.1 | 116.84,47.62 125.09,47.62 T4.1 125.09,55.25 R13.1 R12.1 | 116.84,47.62 T3.1 | T1.1 91.44,38.73 87,38.73
  Bottom 1.524: NODEMCU.VIN 79.02,38.73 87,38.73 87.63,38.73 88.27,39.37 88.27,59.69 85.72,59.69 C3.1 | OPTIONAL2.4 OPTIONAL.4 DISPLAY.4 | OPTIONAL2.4 14.61,47.62 AC-DC.V+1 9.53,42.55 AC-DC.V+2 | OPTIONAL2.4 C2.1 6.98,53.97 6.35,54.61 C5.+ | X26.1 X26.2

### Text on the board
tNames: Sen-In | V | GND | Sen-Out | V | GND | GND | 5V | Taupunktlüftung / V230217 | I2C | ESP8266 | Reset | 250V | Designed by TriCX / for my friend Otello | PWR-SW | L-IN | N | Earth | PWR-SW | L-SW | Out1 | Out2 | Out3 | Out4
bNames: SCL | SDA | GND | 5V | GND | NC | VCC | VCC | N | N | L
tValues: GND